# Altium schematic sheet Microcontroller.SchDoc
size A4; SheetNumber: 7; SheetTotal: 7; SPICEModelCacheTAOBNIVI: <root> / <DocumentId>TAOBNIVI</DocumentId> / </root>
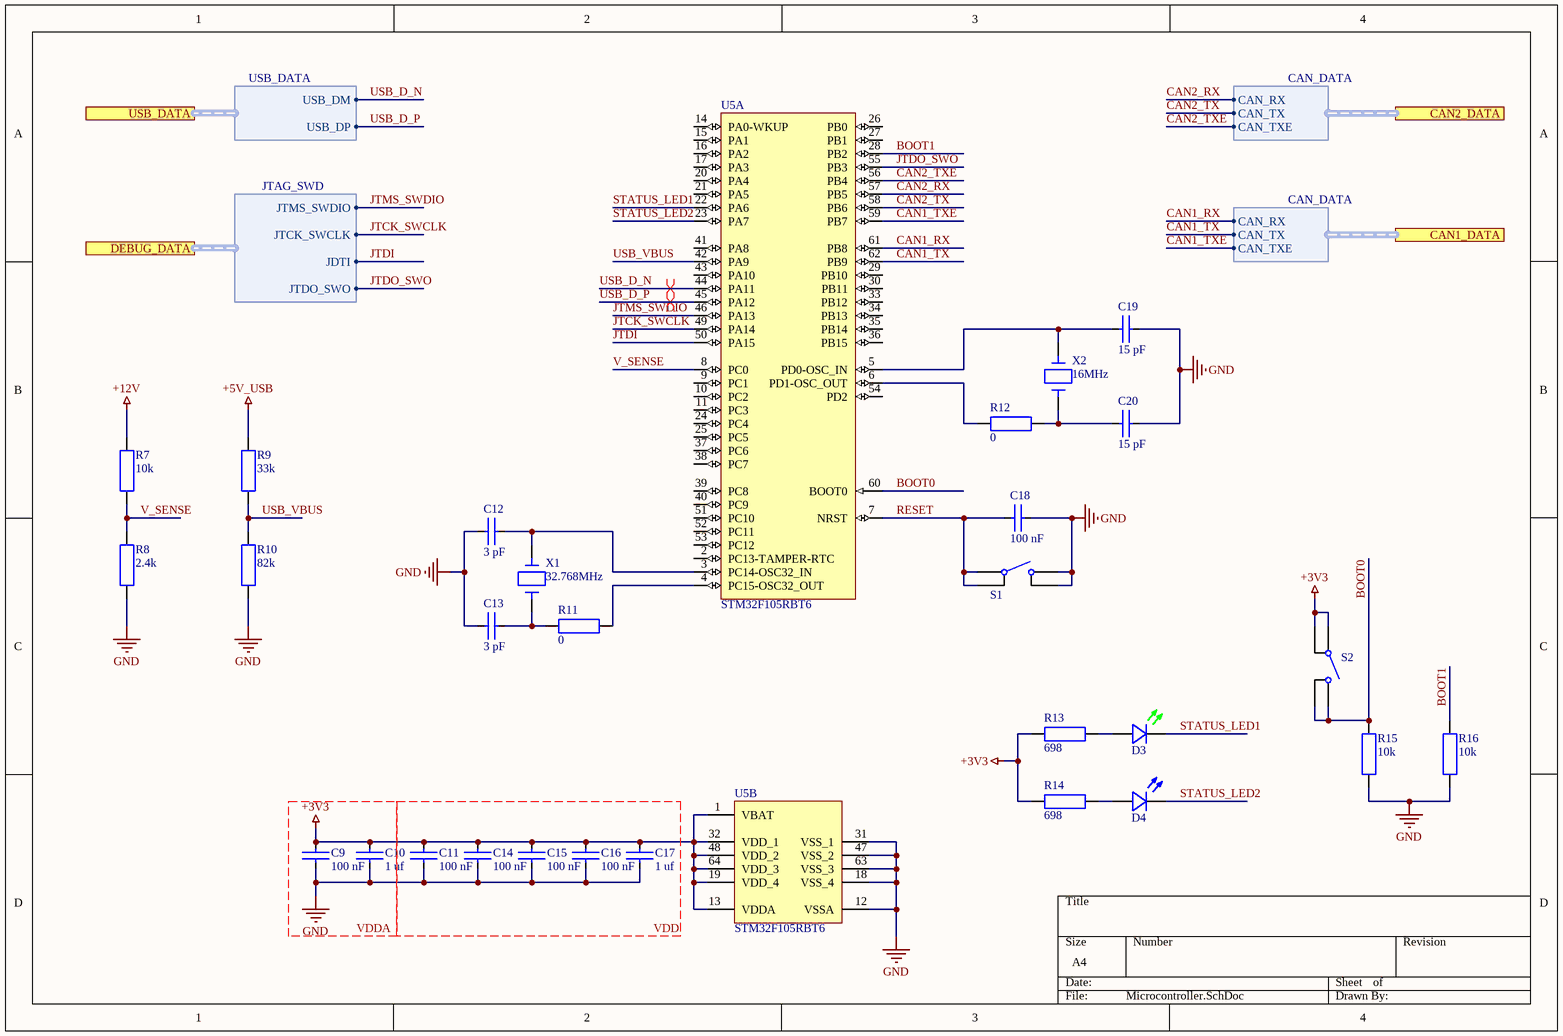
[diagram p0: Microcontroller.SchDoc]

## Parts
C9  100 nF  [0603 SMD CAP]
C10  1 uf  [0603 SMD CAP]
C11  100 nF  [0603 SMD CAP]
C12  3 pF  [0603 SMD CAP]
C13  3 pF  [0603 SMD CAP]
C14  100 nF  [0603 SMD CAP]
C15  100 nF  [0603 SMD CAP]
C16  100 nF  [0603 SMD CAP]
C17  1 uf  [0603 SMD CAP]
C18  100 nF  [0603 SMD CAP]
C19  15 pF  [0603 SMD CAP]
C20  15 pF  [0603 SMD CAP]
D3  LED Green 0603  [0603 SMD LED]  (value not drawn)
D4  LED Blue 0603  [0603 SMD LED]  (value not drawn)
R7  10k  [0603 SMD Res]
R8  2.4k  [0603 SMD Res]
R9  33k  [0603 SMD Res]
R10  82k  [0603 SMD Res]
R11  0  [0603 SMD Res]
R12  0  [0603 SMD Res]
R13  698  [0603 SMD Res]
R14  698  [0603 SMD Res]
R15  10k  [0603 SMD Res]
R16  10k  [0603 SMD Res]
S1  Tactile SPST Switch  [Tactile Switch 4.2x3.4]  (value not drawn)
S2  Tactile SPST Switch  [Tactile Switch 4.2x3.4]  (value not drawn)
U5  STM32F105RBT6  [STM-LQFP64_V]  (parts A,B of 2)
X1  32.768MHz  [3215 SMD CRYSTAL]
X2  16MHz  [3225 SMD Crystal]

## Ports
CAN1_DATA (harness CAN_DATA, see Adapter_Func[2B]), CAN2_DATA (harness CAN_DATA, see Adapter_Func[2B]), DEBUG_DATA (harness JTAG_SWD, see Adapter_Func[2A], JTAG-SW Connector[1B]), USB_DATA (harness USB_DATA, see Adapter_Func[3B], USB Connector[4B])

## Harnesses
CAN_DATA: CAN_RX, CAN_TX, CAN_TXE
USB_DATA: USB_DM, USB_DP
JTAG_SWD: JTMS_SWDIO, JTCK_SWCLK, JDTI, JTDO_SWO

## Nets
+3V3: C9.2 C10.2 C11.2 C14.2 C15.2 C16.2 C17.2 R13.2 R14.2 S2.1 S2.2 U5.1(VBAT) U5.13(VDDA) U5.19(VDD_4) U5.32(VDD_1) U5.48(VDD_2) U5.64(VDD_3)
+5V_USB: R9.2
+12V: R7.2
GND: C9.1 C10.1 C11.1 C12.1 C13.1 C14.1 C15.1 C16.1 C17.1 C18.2 C19.2 C20.2 R8.1 R10.1 R15.1 R16.1 S1.3 S1.4 U5.12(VSSA) U5.18(VSS_4) U5.31(VSS_1) U5.47(VSS_2) U5.63(VSS_3)
BOOT0: R15.2 S2.3 S2.4 U5.60(BOOT0)
BOOT1: R16.2 U5.28(PB2)
CAN1_RX: U5.61(PB8) ; port CAN1_DATA.CAN_RX
CAN1_TX: U5.62(PB9) ; port CAN1_DATA.CAN_TX
CAN1_TXE: U5.59(PB7) ; port CAN1_DATA.CAN_TXE
CAN2_RX: U5.57(PB5) ; port CAN2_DATA.CAN_RX
CAN2_TX: U5.58(PB6) ; port CAN2_DATA.CAN_TX
CAN2_TXE: U5.56(PB4) ; port CAN2_DATA.CAN_TXE
JTCK_SWCLK: U5.49(PA14) ; port DEBUG_DATA.JTCK_SWCLK
JTDI: U5.50(PA15) ; port DEBUG_DATA.JDTI
JTDO_SWO: U5.55(PB3) ; port DEBUG_DATA.JTDO_SWO
JTMS_SWDIO: U5.46(PA13) ; port DEBUG_DATA.JTMS_SWDIO
RESET: C18.1 S1.1 S1.2 U5.7(NRST)
STATUS_LED1: D3.2 U5.22(PA6)
STATUS_LED2: D4.2 U5.23(PA7)
USB_D_N: U5.44(PA11) ; port USB_DATA.USB_DM
USB_D_P: U5.45(PA12) ; port USB_DATA.USB_DP
USB_VBUS: R9.1 R10.2 U5.42(PA9)
V_SENSE: R7.1 R8.2 U5.8(PC0)
NetC12_2: C12.2 U5.3(PC14-OSC32_IN) X1.2
NetC13_2: C13.2 R11.2 X1.1
NetC19_1: C19.1 U5.5(PD0-OSC_IN) X2.3
NetC20_1: C20.1 R12.1 X2.1
NetD3_1: D3.1 R13.1
NetD4_1: D4.1 R14.1
NetR11_1: R11.1 U5.4(PC15-OSC32_OUT)
NetR12_2: R12.2 U5.6(PD1-OSC_OUT)

Not connected (* = marked no-connect by the designer): U5 2(PC13-TAMPER-RTC) 9(PC1) 10(PC2) 11(PC3) 14(PA0-WKUP) 15(PA1) 16(PA2) 17(PA3) 20(PA4) 21(PA5) 24(PC4) 25(PC5) 26(PB0) 27(PB1) 29(PB10) 30(PB11) 33(PB12) 34(PB13) 35(PB14) 36(PB15) 37(PC6) 38(PC7) 39(PC8) 40(PC9) 41(PA8) 43(PA10) 51(PC10) 52(PC11) 53(PC12) 54(PD2)

## Layout directives
differential pair: USB_D_N, USB_D_P

## Notes on the sheet
- VDDA
- VDD

## Library data of the parts
C9 C11 C14-C16 C18 = Cap 100nF 0603: 25V 100nF X7R ±10% 0603 Multilayer Ceramic Capacitors MLCC; Part Number: CL10B104KA8NNNC; ComponentLink1Description: LCSC; ComponentLink1URL: https://lcsc.com/product-detail/Multilayer-Ceramic-Capacitors-MLCC-SMD-SMT_Samsung-Electro-Mechanics-CL10B104KA8NNNC_C1590.html
C10 C17 = Cap 1u 0603: 25V 1uF X5R ±10% 0603 Multilayer Ceramic Capacitors MLCC; Part Number: CC0603KRX5R8BB105
C12 C13 = Cap 3pF 0603: 50V 3pF NP0 0.25pF 0603 Multilayer Ceramic Capacitors MLCC; Part Number: CC0603JRNPO9BN100
C19 C20 = Cap 15pF 0603: 50V 15pF NP0 ±5% 0603 Multilayer Ceramic Capacitors MLCC; Part Number: CC0603JRNPO9BN100
D3 = LED Green 0603: 20mA 518nm Colorless transparence -40℃~+85℃ 520nm~535nm Emerald 120° 110mW 0603; Part Number: 19-217/GHC-YR1S2/3T; ComponentLink1Description: Datasheet; ComponentLink1URL: https://datasheet.lcsc.com/lcsc/1811101510_Everlight-Elec-19-217-GHC-YR1S2-3T_C72043.pdf
D4 = LED Blue 0603: 25mA Green -30℃~+85℃ Positive post Blue 120° 80mW 0603; Part Number: XL-1608BGWC-06; ComponentLink1Description: Datasheet; ComponentLink1URL: https://datasheet.lcsc.com/lcsc/2211030000_XINGLIGHT-XL-1608BGWC-06_C965809.pdf
R7 R15 R16 = Resistor 10k 0603 1%: Part Number: RC0603FR-0710KL
R8 = Resistor 2.4k 0603 1%: 100mW Thick Film Resistors 75V ±100ppm/℃ ±1% -55℃~+155℃ 2.4kΩ 0603 Chip Resistor; Part Number: RC0603FR-072K4L
R9 = Resistor 33k 0603: 100mW Thin Film Resistor 75V ±25ppm/℃ ±1% -55℃~+155℃ 33kΩ 0603 Chip Resistor; Part Number: ARG03FTC3302; ComponentLink1Description: LCSC; ComponentLink1URL: https://lcsc.com/product-detail/Chip-Resistor-Surface-Mount_Viking-Tech-ARG03FTC3302_C217971.html
R10 = Resistor 82k 0603: 100mW Thick Film Resistors 50V ±100ppm/℃ ±1% -55℃~+155℃ 82kΩ 0603 Chip Resistor; Part Number: FRC0603F8202TS; ComponentLink1Description: LCSC; ComponentLink1URL: https://lcsc.com/product-detail/Chip-Resistor-Surface-Mount_FOJAN-FRC0603F8202TS_C2907072.html
R11 R12 = Resistor 0 0603: Thick Film Resistors -55℃~+155℃ 0Ω 0603 Chip Resistor; Part Number: FRC0603P000 TS; ComponentLink1Description: LCSC; ComponentLink1URL: https://lcsc.com/product-detail/Chip-Resistor-Surface-Mount_FOJAN-FRC0603P000-TS_C2907080.html
R13 R14 = Resistor 698 0603 1%: 100mW Thick Film Resistors 75V ±100ppm/℃ ±1% -55℃~+155℃ 698Ω 0603 Chip Resistor; Part Number: AC0603FR-07698RL; ComponentLink1Description: LCSC; ComponentLink1URL: https://lcsc.com/product-detail/Chip-Resistor-Surface-Mount_YAGEO-AC0603FR-07698RL_C144640.html
S1 S2 = Tactile SPST Switch: Part Number: YTSA016C0254004B; ComponentLink1Description: Datasheet; ComponentLink1URL: https://datasheet.lcsc.com/lcsc/2106061735_DGBZ-YTSA016C0254004B_C2764970.pdf
U5 = CMP-0237-00224-3: ARM Cortex-M3 32-bit MCU, 128 KB Flash, 64 KB Internal RAM, 51 I/Os, 64-pin LQFP, -40 to 85 degC, Tray; D/A Converter: 2x12-bit (2 Channel); Supply Voltage(Vcc) min (V): 2; A/D Converter: 2x12-bit (16 Channel); Internal RAM Size (kB): 64; Operating Frequency(F) (Processor speed) (MHz): 72; FLASH Size (Prog) (kB): 128; I/Os (High Current): 51; ComponentLink2Description: Datasheet; Core: ARM Cortex-M3; ComponentLink2URL: http://www.st.com/st-web-ui/static/active/en/resource/technical/document/datasheet/CD00220364.pdf; Mounting Technology: Surface Mount; PackageVersion: Rev. 4, 06/2013; PackageReference: LQFP64; PartNumber: STM32F105RBT6; ComponentLink3URL: http://www.st.com/st-web-ui/static/active/en/resource/technical/document/datasheet/DM00037051.pdf; DatasheetVersion: Rev. 6; PackageDescription: 64-Pin Low Profile Quad Flat Package, 10 x 10 mm Body, 0.5 mm Pitch; ComponentLink3Description: Package Specification; ComponentLink1Description: Manufacturer URL; ComponentLink1URL: http://www.st.com/web/en/home.html; Packing: Tray
X1 = Crystal 32.768MHz SMD: 32.768kHz 6pF 70kΩ ±20ppm -40℃~+85℃ SMD3215-2P Crystals ROHS; Part Number: NX3215SA-32.768K-STD-MUA-14; ComponentLink1Description: Datasheet; ComponentLink1URL: https://datasheet.lcsc.com/lcsc/1810171130_NDK-NX3215SA-32-768K-STD-MUA-14_C156244.pdf
X2 = Crystal 16MHz 3225: Crystal 16MHz 12pf; ComponentLink1Description: ChipDip; ComponentLink1URL: https://www.chipdip.ru/product0/8010531849